# EAGLE design USB-Isolator_v10 (EAGLE 7.5.0)
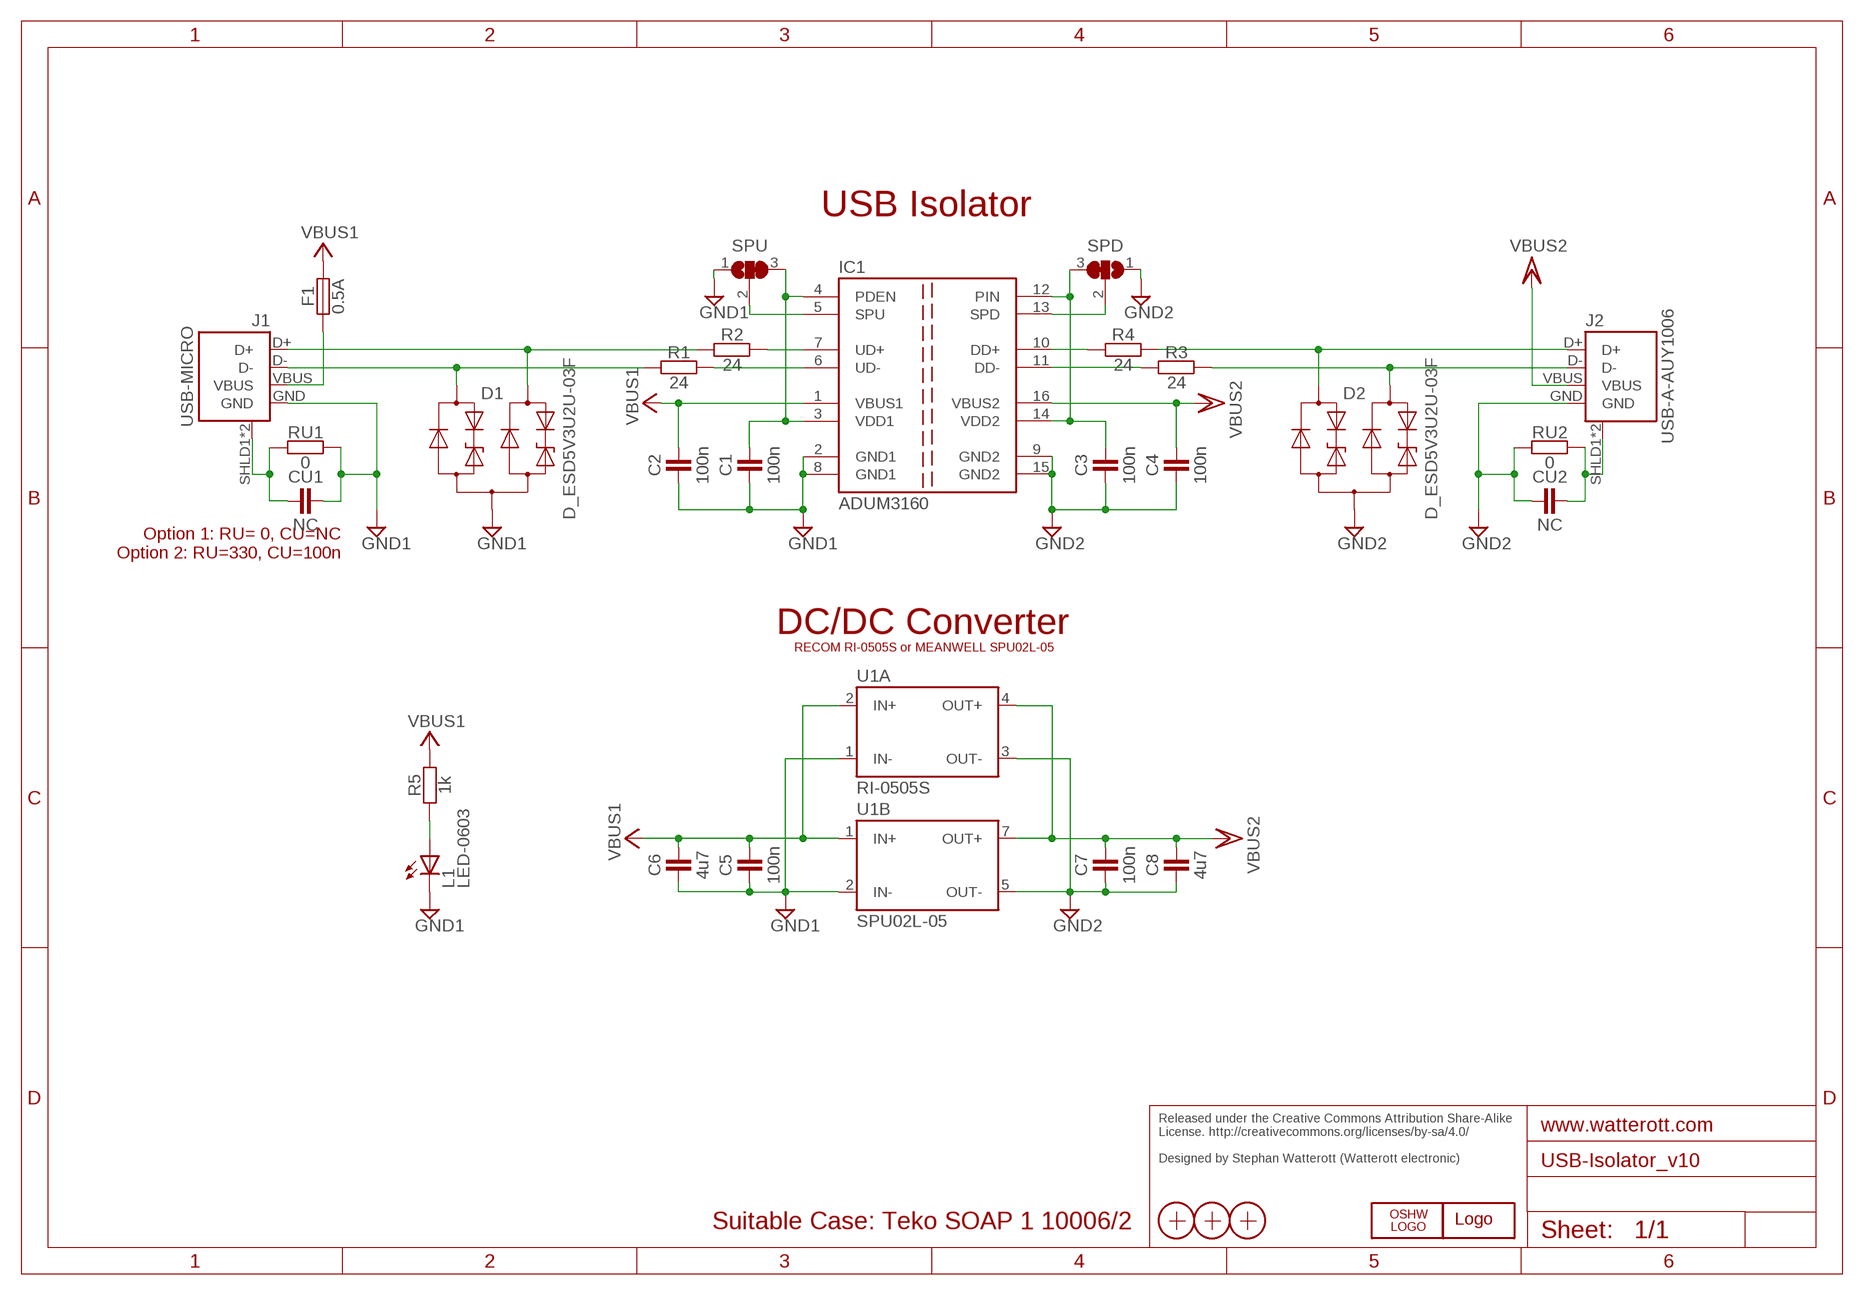
[diagram p0: schematic, sheet 1]

## Parts
C1  100n  CAPACITOR-C0603  [R0603]
C2  100n  CAPACITOR-C0603  [R0603]
C3  100n  CAPACITOR-C0603  [R0603]
C4  100n  CAPACITOR-C0603  [R0603]
C5  100n  CAPACITOR-C0603  [R0603]
C6  4u7  CAPACITOR-C1206  [R1206]
C7  100n  CAPACITOR-C0603  [R0603]
C8  4u7  CAPACITOR-C1206  [R1206]
CU1  NC  CAPACITOR-C0603  [R0603]
CU2  NC  CAPACITOR-C0603  [R0603]
D1  D_ESD5V3U2U-03F  [TSFP3]
D2  D_ESD5V3U2U-03F  [TSFP3]
F1  0.5A  FUSE-0805  [R0805]
IC1  ADUM3160  [SO16W]
J1  USB-MICRO  [USB-MICRO-10103594]
J2  USB-A-AUY1006  [USB-AU-Y1006-R]
L1  LED-0603  [LED_0603]
LOGO2  OSHW_LOGOX0070  [OSHW_6X70]
LOGO3  LOGO-S_PLACE_M  [SPARK_TPLACE_M]
R1  24  RESISTOR-R0603  [R0603]
R2  24  RESISTOR-R0603  [R0603]
R3  24  RESISTOR-R0603  [R0603]
R4  24  RESISTOR-R0603  [R0603]
R5  1k  RESISTOR-R0603  [R0603]
RU1  0  RESISTOR-R0603  [R0603]
RU2  0  RESISTOR-R0603  [R0603]
SPD  JUMPER3  [JUMPER3]
SPU  JUMPER3  [JUMPER3]
U1A  RI-0505S  DC/DC-RI  [RECOM_SIP4_RI]
U1B  SPU02L-05  DC/DC-SPU02  [MEANWELL_SIP7_SPU02]
X1  PASSER-07  [PASSER_07MM]
X2  PASSER-07  [PASSER_07MM]
X3  PASSER-07  [PASSER_07MM]

## Nets
D1_N: D1.1(C1) J1.D- R1.1
D1_P: D1.2(C2) J1.D+ R2.1
D2_N: D2.2(C2) J2.D- R3.2
D2_P: D2.1(C1) J2.D+ R4.2
DD+: IC1.10(DD+) R4.1
DD-: IC1.11(DD-) R3.1
GND1: C1.1 C2.1 C5.1 C6.1 CU1.2 D1.3(A) IC1.2(GND1) IC1.8(GND1) J1.GND L1.C RU1.2 SPU.1 U1A.1(IN-) U1B.2(IN-)
GND2: C3.1 C4.1 C7.1 C8.1 CU2.1 D2.3(A) IC1.9(GND2) IC1.15(GND2) J2.GND RU2.1 SPD.1 U1A.3(OUT-) U1B.5(OUT-)
LED: L1.A R5.1
SHLD1: CU1.1 J1.SHLD1(SHIELD) J1.SHLD2(SHIELD) RU1.1
SHLD2: CU2.2 J2.SHLD1(SHIELD) J2.SHLD2(SHIELD) RU2.2
SPD: IC1.13(SPD) SPD.2
SPU: IC1.5(SPU) SPU.2
UD+: IC1.7(UD+) R2.2
UD-: IC1.6(UD-) R1.2
VBUS1: C2.2 C5.2 C6.2 F1.2 IC1.1(VBUS1) R5.2 U1A.2(IN+) U1B.1(IN+)
VBUS1A: F1.1 J1.VBUS
VBUS2: C4.2 C7.2 C8.2 IC1.16(VBUS2) J2.VBUS U1A.4(OUT+) U1B.7(OUT+)
VDD1: C1.2 IC1.3(VDD1) IC1.4(PDEN) SPU.3
VDD2: C3.2 IC1.12(PIN) IC1.14(VDD2) SPD.3

## Notes on the sheet
- USB Isolator
- Option 1: RU= 0, CU=NC
  Option 2: RU=330, CU=100n
- DC/DC Converter
- RECOM RI-0505S or MEANWELL SPU02L-05
- Released under the Creative Commons Attribution Share-Alike 
  License. http://creativecommons.org/licenses/by-sa/4.0/
  
  Designed by Stephan Watterott (Watterott electronic)
- Suitable Case: Teko SOAP 1 10006/2

## Library data of the parts
C1-C8 CU1 CU2 = we-rcl:CAPACITOR: Capacitors ...2.2uF -> 0603 ...4.7uF -> 0805 ...10uF -> 1206
D1 D2 = we-rcl:D_ESD5V3U2U: TVS Diode - Uni-directional Ultra Low ESD / Transient Protection Diode (0.4pF@1MHz); DIGIKEY: ESD5V3U2U-03F H6327DKR-ND
F1 = we-rcl:FUSE: Fuses
IC1 = we-chip:ADUM3160: Analog Devices ADuM3160 (pin compatible with ADuM4160) USB port isolator
J1 = we-con:USB: USB Connectors; DIGIKEY: 609-4050-6-ND
J2 = we-con:USB: USB Connectors; DIGIKEY: AE9924-ND; MANUFACTURER: AU-Y1006-R
L1 = we-opto:LED: LEDs
LOGO2 = we-symbol:OSHW_LOGO: Open-Source-Hardware Logo
LOGO3 = we-symbol:LOGO: Watterott electronic Logo
R1-R5 RU1 RU2 = we-rcl:RESISTOR: Resistors all kinds in 0603
SPD SPU = we-rcl:JUMPER3: 3 Pin Jumpers
U1A U1B = we-power:DC/DC: DC/DC Converter from Meanwell and Recom
X1-X3 = we-symbol:PASSER: Fiducial Markers

## Board
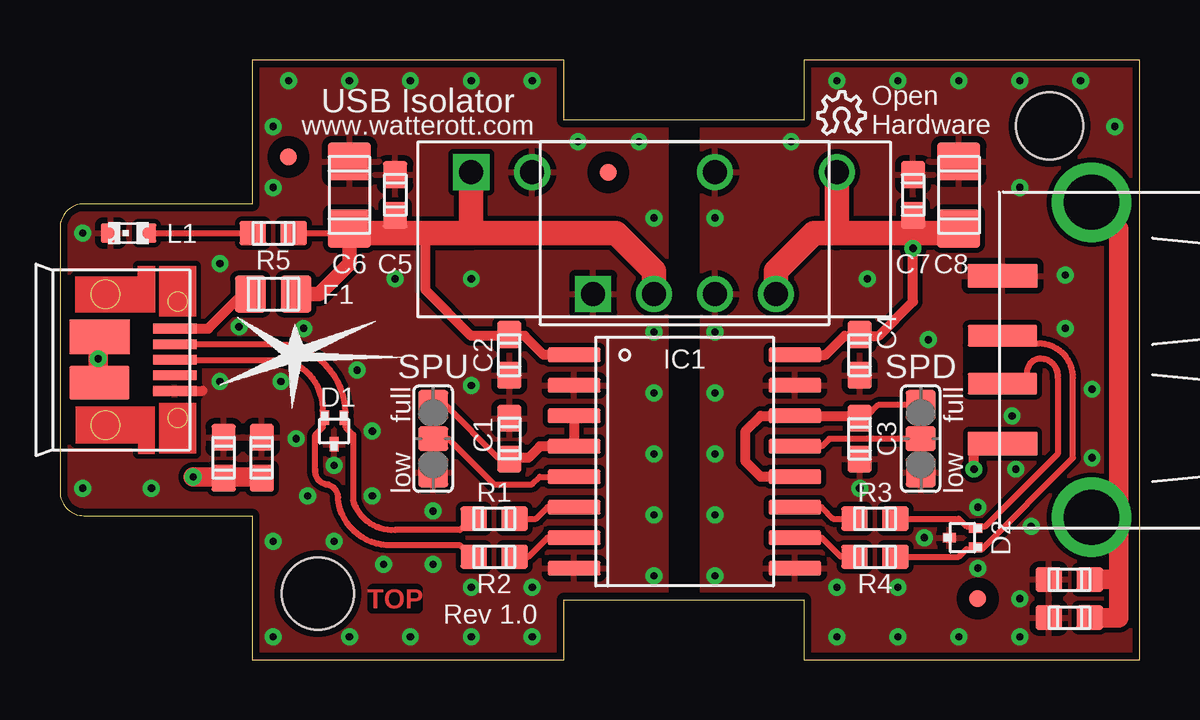
[diagram p1: board, top side]
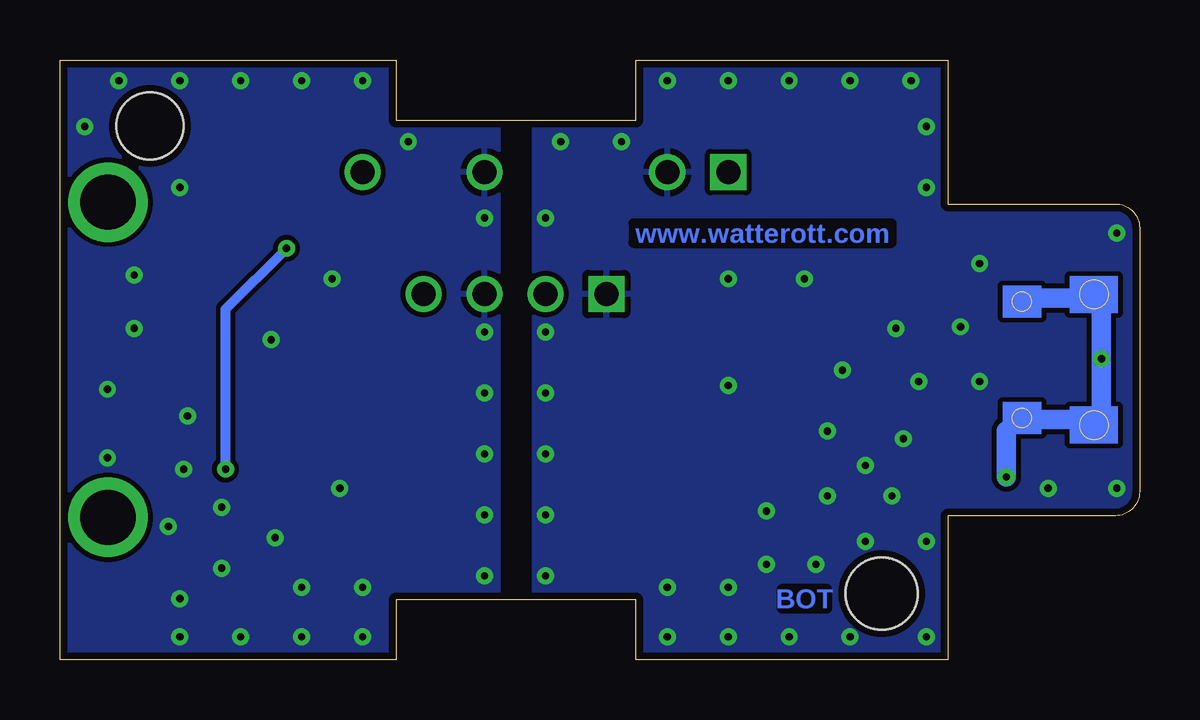
[diagram p2: board, bottom side, seen from below]

Size 45 x 25 mm. Coordinates in mm from the lower left corner, seen from the top.
Outline: 8,0 21,0 21,2.5 31,2.5 31,0 45,0 45,25 31,25 31,22.5 21,22.5 21,25 8,25 8,19 1,19 arc90 0,18 0,7 arc90 1,6 8,6 8,0
Copper layers (1*16): Top 0.035mm / dielectric 1.5mm / Bottom 0.035mm
Design rules "watterott *": minimum track width 6mil, minimum drill 0.29mm, track to track 6mil, track to pad 6mil, pad to pad 6mil, via to via 6mil, smd to smd 6mil, copper to edge 0.3mm, drill to drill 8mil, minimum pad ring 10mil, minimum via ring 8mil, stop-mask expansion 0.3mm, vias tented up to drill 0.5mm, thermal gap 10mil
Holes 3 mm at 10.75,2.75
Holes 2.8 mm at 41.25,22.25
tRestrict: area 37.8,12 to 40.8,13

### Footprints (pad centres in the part's own frame; a part is rotated, then mirrored left to right if it is on the bottom)
R0603 = smd 1 x 1.1: 1 0,0.85; 2 0,-0.85
R1206 = smd 1.8 x 1.6: 1 0,1.4; 2 0,-1.4
TSFP3 = smd 0.6 x 0.4: 1 -0.55,0.4; 2 -0.55,-0.4; 3 0.55,0
R0805 = smd 1.55 x 1.3: 1 0,0.95; 2 0,-0.95
SO16W = smd 2.2 x 0.6: 1 -4.6,4.445; 2 -4.6,3.175; 3 -4.6,1.905; 4 -4.6,0.635; 5 -4.6,-0.635; 6 -4.6,-1.905; 7 -4.6,-3.175; 8 -4.6,-4.445; 9 4.6,-4.445; 10 4.6,-3.175; 11 4.6,-1.905; 12 4.6,-0.635; 13 4.6,0.635; 14 4.6,1.905; 15 4.6,3.175; 16 4.6,4.445
USB-MICRO-10103594 = smd 1.85 x 0.4: D+ -2.885,0; D- -2.885,-0.65; GND -2.885,1.3; ID -2.885,0.65; VBUS -2.885,-1.3 | smd 2.5 x 1.425: SHLD1 0.25,-0.963; SHLD2 0.25,0.963
USB-AU-Y1006-R = smd 2.9 x 0.9: D+ -3.71,1; D- -3.71,-1 | smd 2.9 x 1: GND -3.71,3.5; VBUS -3.71,-3.5 | drill 2.3: SHLD1 0,-6.57; SHLD2 0,6.57
LED_0603 = smd 0.8 x 0.8: A 0,-0.75; C 0,0.75
JUMPER3 = smd 1.25 x 1.25: 1 0,1.4; 3 0,-1.4 | smd 1.25 x 1: 2 0,0
RECOM_SIP4_RI = drill 1 square: 1 -3.81,0 | drill 1: 2 -1.27,0; 3 1.27,0; 4 3.81,0
MEANWELL_SIP7_SPU02 = drill 1 square: 1 -7.62,0 | drill 1: 2 -5.08,0; 5 2.54,0; 7 7.62,0
PASSER_07MM = smd 0.7 x 0.7: X 0,0

### Placement (x,y rotation side)
C1  18.73,9.21 0 top
C2  18.73,12.7 180 top
C3  33.34,9.21 180 top
C4  33.34,12.7 180 top
C5  13.97,19.37 0 top
C6  12.06,19.37 0 top
C7  35.56,19.37 0 top
C8  37.47,19.37 0 top
CU1  6.83,8.41 180 top
CU2  42.07,3.33 90 top
D1  11.43,9.53 270 top
D2  37.62,5.08 180 top
F1  8.89,15.24 90 top
IC1  26.04,8.26 0 top
J1  1.9,12.5 180 top
J2  43,12.5 0 top
L1  2.86,17.78 90 top
LOGO2  31.59,21.91 0 top
LOGO3  9.84,12.7 0 top
R1  18.1,5.87 90 top
R2  18.1,4.29 90 top
R3  33.97,5.87 90 top
R4  33.97,4.29 90 top
R5  8.89,17.78 90 top
RU1  8.41,8.41 180 top
RU2  42.07,1.75 90 top
SPD  35.88,9.21 180 top
SPU  15.56,9.21 180 top
U1A  26.04,15.24 0 top
U1B  24.77,20.32 0 top
X1  9.53,20.95 0 top
X2  22.86,20.32 0 top
X3  38.26,2.54 0 top

### Tracks (layer width: path | path; a pad name or v marks a point on that pad's centre or on a via)
D1_N
  Top 0.254: R1.1 17.14,5.87 16.67,5.4 13.97,5.4 arc-79 12.22,6.67 12.22,9.37 11.91,9.68 11.91,10 | D1.1 11.91,10 | 11.91,10 11.91,10.32 arc90 8.92,13.15 J1.D-
D1_P
  Top 0.254: R2.1 17.14,4.29 16.67,4.76 13.81,4.76 arc-83 11.59,6.67 arc90 11.11,7.3 arc-90 10.64,7.94 10.64,9.37 10.95,9.68 10.95,10 | D1.2 10.95,10 | 10.95,10 10.95,10.32 arc90 9.09,12.5 J1.D+
D2_N
  Top 0.254: R3.2 37.47,5.87 37.78,5.56 38.26,5.56 | 38.26,5.56 38.58,5.56 41.59,8.57 41.59,11.75 arc90 40.96,12.54 arc90 40.32,12.06 40.32,11.75 40.08,11.5 J2.D- | D2.2 38.18,5.48 38.26,5.56
D2_P
  Top 0.254: R4.2 37.47,4.29 37.78,4.6 38.26,4.6 | 38.26,4.6 38.42,4.6 42.23,8.41 42.23,11.75 arc90 40.8,13.18 40.32,13.18 40,13.5 J2.D+ | D2.1 38.18,4.68 38.26,4.6
DD+
  Top 0.254: R4.1 32.54,4.29 31.75,5.08 IC1.10
DD-
  Top 0.254: IC1.11 31.75,6.35 32.23,5.87 R3.1
GND1  (via drill 0.3)
  Top 0.406: J1.GND 5.95,11.2
  other vias: 17.14,0.95 24.77,8.57 24.77,6.03 19.68,0.95 9.53,24.13 12.06,24.13 14.61,24.13 8.89,22.23 17.14,24.13 19.68,24.13 21.59,21.59 24.13,21.59 14.61,0.95 12.06,0.95 6.67,11.59 0.95,17.78 24.77,11.11 24.77,13.65 8.89,19.68 8.89,0.95 8.89,4.92 24.77,18.41 24.77,3.49 13.97,15.88 17.14,11.43 9.21,11.59 0.95,7.14 3.81,7.14 13.02,9.53 6.67,16.51 15.56,6.19 17.14,15.88 11.43,8.1 13.02,6.83 7.46,13.88 10.16,13.81 12.38,12.06 15.56,3.97 9.84,9.21 10.32,6.83 11.43,4.92 13.49,3.97 19.68,3.02 17.14,3.02
  pour Top (isolate 0.203): 0,25 25.25,25 25.25,0 0,0
  pour Bottom (isolate 0.203): 0,25 25.25,25 25.25,0 0,0
GND2  (via drill 0.3)
  other vias: 30.48,21.59 42.55,24.13 32.38,24.13 34.92,24.13 37.47,24.13 40.01,24.13 27.3,13.65 27.3,11.11 27.3,6.03 27.3,8.57 27.3,3.49 32.38,0.95 34.92,0.95 37.47,0.95 40.01,0.95 41.91,16.03 43.97,22.23 40.01,2.54 33.34,7.14 27.3,18.41 36.2,13.34 33.66,15.88 40.01,19.68 32.38,3.02 36.04,5.08 39.85,7.94 38.26,6.35 38.26,3.81 40.48,5.56 34.92,3.02 39.69,10.16 41.91,13.81 43.02,8.41 43.02,11.27
  pour Top (isolate 0.203): 26.75,25 26.75,0 45,0 45,25
  pour Bottom (isolate 0.203): 26.75,25 26.75,0 45,0 45,25
LED
  Top 0.254: L1.A R5.1
SHLD1  (via drill 0.3)
  Top 0.254: 6.77,7.62 CU1.1 6.83,7.62 | 8.36,7.62 RU1.1
  Top 0.813: v5.56,7.62 6.77,7.62 | 6.83,7.62 8.36,7.62 | J1.SHLD1 1.59,13.4 v1.59,12.54 1.59,11.6 J1.SHLD2 1.59,11.59
  Bottom 0.813: v5.56,7.62 5.56,9.53 5.08,10 1.59,10 v1.59,12.54 1.59,15.08 5.24,15.08
SHLD2
  Top 0.254: J2.SHLD2
  Top 0.813: J2.SHLD2 44.13,17.94 44.13,6.19 | 44.13,6.19 44.13,3.33 | 44.13,3.33 44.13,1.75 RU2.2 | CU2.2 44.13,3.33 | J2.SHLD1 43.87,5.93 44.13,6.19
SPD
  Top 0.254: SPD.2 32.07,9.21 31.75,8.89 IC1.13
SPU
  Top 0.254: SPU.2 16.19,9.21 18.1,7.3 19.68,7.3 20,7.62 IC1.5
UD+
  Top 0.254: R2.2 19.53,4.29 20.32,5.08 IC1.7
UD-
  Top 0.254: R1.2 19.84,5.87 20.32,6.35 IC1.6
VBUS1
  Top 0.254: C6.2 12.06,17.78 | R5.2 11.88,17.78
  Top 0.406: 11.88,17.78 C6.2 | 15.24,17.78 15.24,15.4 17.14,13.49 18.79,13.49 | IC1.1 20.16,12.7 19.37,13.49 18.89,13.49 | 18.89,13.49 18.79,13.49 | 18.79,13.49 C2.2 18.84,13.55 18.89,13.49
  Top 0.61: C5.2 13.97,17.78 | F1.2 10.79,15.24 12.06,16.51 C6.2
  Top 1.016: U1A.2 24.77,16.19 23.18,17.78 17.14,17.78 | 17.14,17.78 U1B.1 | 12.06,17.78 13.97,17.78 15.24,17.78 17.14,17.78
VBUS1A
  Top 0.406: J1.VBUS 6.18,13.8 7.62,15.24 F1.1
VBUS2  (via drill 0.3)
  Top 0.254: 39.37,8.89 39.29,8.97 J2.VBUS 39.18,8.89 38.42,8.89 38.1,8.57
  Top 0.406: v38.1,7.94 38.1,8.57 | v35.56,17.14 35.56,14.92 34.13,13.49 33.34,13.49 C4.2 33.28,13.49 32.7,13.49 31.91,12.7 IC1.16
  Top 0.61: C8.2 37.47,17.78 | C7.2 35.56,17.78 v35.56,17.14
  Top 1.016: U1A.4 29.84,16.19 31.43,17.78 32.38,17.78 | 32.38,17.78 U1B.7 | 37.47,17.78 35.56,17.78 32.38,17.78
  Bottom 0.406: v38.1,7.94 38.1,14.61 v35.56,17.14
VDD1
  Top 0.254: SPU.3 16.06,10.61 18.26,8.41 18.68,8.41 C1.2 18.79,8.41 | IC1.4 21.27,8.89 21.43,9.05
  Top 0.406: 21.27,8.89 20,8.89 19.53,8.41 18.79,8.41 | IC1.3 21.43,9.05
VDD2
  Top 0.254: 33.23,10.16 C3.2 33.44,10.16 33.66,10.16 34.1,10.61 SPD.3
  Top 0.406: IC1.12 29.21,7.62 28.57,8.26 28.57,9.53 29.21,10.16 IC1.14 33.23,10.16

### Text on the board
Top: TOP
Bottom: www.watterott.com | BOT
tPlace: USB Isolator | www.watterott.com | Open / Hardware | full | full | low | low | Rev 1.0
Reference: Silkscreen: 21 tPlace + 25 tNames